# Altium project BLDC_DRIVER_DOOR.PrjPcb
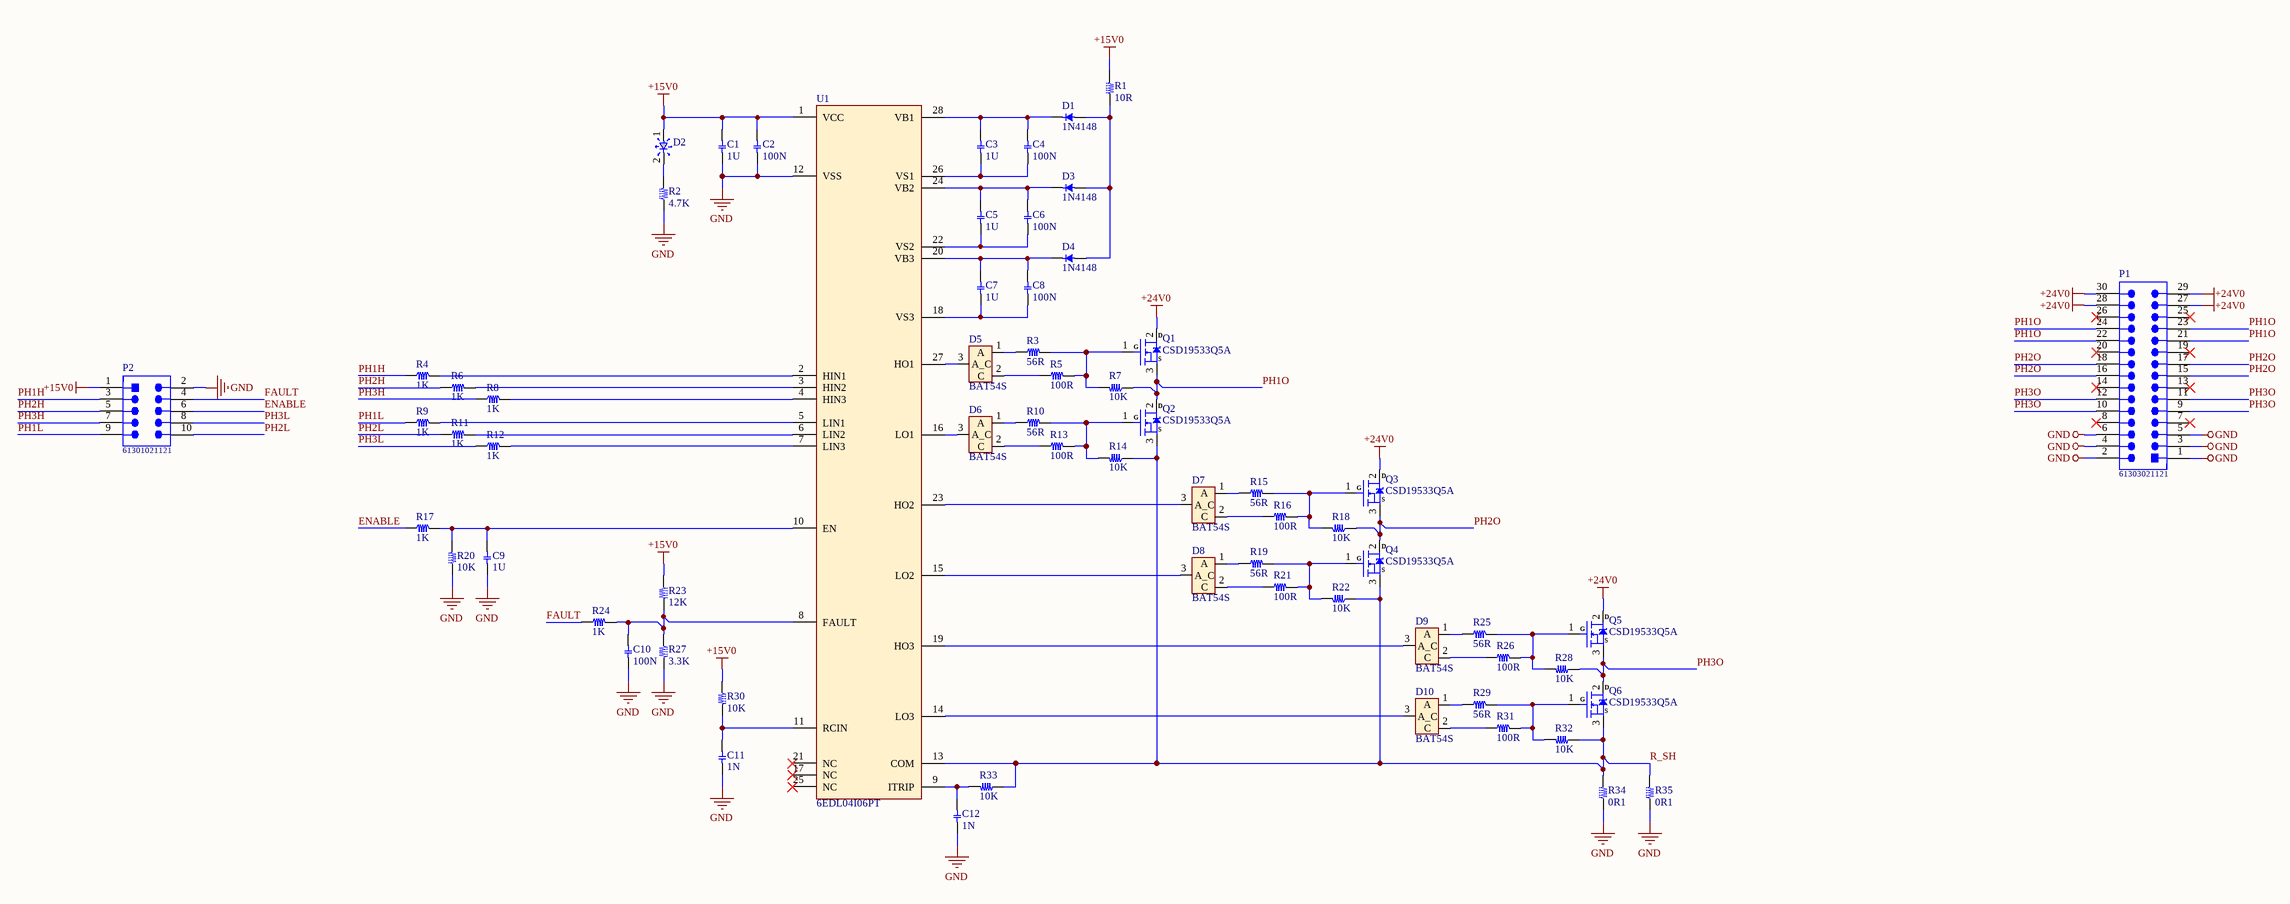
[diagram p0: BLDC_DRIVER_DOOR.SchDoc]
1 sheet, 66 parts. Net scope: global (net labels, ports and power ports of the same name join across sheets).
Board file: BLDC_DRIVER_DOOR.PcbDoc

## Sheet BLDC_DRIVER_DOOR.SchDoc
size A0; SheetNumber: 1; SheetTotal: 1

### Parts
C1  1U  [C 0603]
C2  100N  [C 0603]
C3  1U  [C 0805]
C4  100N  [C 0805]
C5  1U  [C 0805]
C6  100N  [C 0805]
C7  1U  [C 0805]
C8  100N  [C 0805]
C9  1U  [C 0603]
C10  100N  [C 0603]
C11  1N  [C 0603]
C12  1N  [C 0805]
D1  1N4148  [D SOD-123]
D2  LED_SMD  [D 0603]  (value not drawn)
D3  1N4148  [D SOD-123]
D4  1N4148  [D SOD-123]
D5  BAT54S  [SOT-23_3_D]
D6  BAT54S  [SOT-23_3_D]
D7  BAT54S  [SOT-23_3_D]
D8  BAT54S  [SOT-23_3_D]
D9  BAT54S  [SOT-23_3_D]
D10  BAT54S  [SOT-23_3_D]
P1  61303021121  [61303021121]
P2  61301021121  [61301021121]
Q1  CSD19533Q5A  [Q5A]
Q2  CSD19533Q5A  [Q5A]
Q3  CSD19533Q5A  [Q5A]
Q4  CSD19533Q5A  [Q5A]
Q5  CSD19533Q5A  [Q5A]
Q6  CSD19533Q5A  [Q5A]
R1  10R  [R 1206]
R2  4.7K  [R 0603]
R3  56R  [R 0805]
R4  1K  [R 0603]
R5  100R  [R 0805]
R6  1K  [R 0603]
R7  10K  [R 0603]
R8  1K  [R 0603]
R9  1K  [R 0603]
R10  56R  [R 0805]
R11  1K  [R 0603]
R12  1K  [R 0603]
R13  100R  [R 0805]
R14  10K  [R 0603]
R15  56R  [R 0805]
R16  100R  [R 0805]
R17  1K  [R 0603]
R18  10K  [R 0603]
R19  56R  [R 0805]
R20  10K  [R 0603]
R21  100R  [R 0805]
R22  10K  [R 0603]
R23  12K  [R 0603]
R24  1K  [R 0603]
R25  56R  [R 0805]
R26  100R  [R 0805]
R27  3.3K  [R 0603]
R28  10K  [R 0603]
R29  56R  [R 0805]
R30  10K  [R 0603]
R31  100R  [R 0805]
R32  10K  [R 0603]
R33  10K  [R 0805]
R34  0R1  [R 2512]
R35  0R1  [R 2512]
U1  6EDL04I06PT  [SOIC-28]

### Nets
+15V0: C1.2 C2.2 D2.1 P2.1 R1.2 R23.1 R30.1 U1.1(VCC)
+24V0: P1.27 P1.28 P1.29 P1.30 Q1.2(D) Q3.2(D) Q5.2(D)
GND: C1.1 C2.1 C9.1 C10.1 C11.1 C12.1 P1.1 P1.2 P1.3 P1.4 P1.5 P1.6 P2.2 R2.1 R20.1 R27.2 R34.1 R35.1 U1.12(VSS)
ENABLE: P2.6 R17.1
FAULT: P2.4 R24.1
PH1H: P2.3 R4.1
PH1L: P2.9 R9.1
PH1O: P1.21 P1.22 P1.23 P1.24 Q1.3(S) Q2.2(D) R7.1
PH2H: P2.5 R6.1
PH2L: P2.10 R11.1
PH2O: P1.15 P1.16 P1.17 P1.18 Q3.3(S) Q4.2(D) R18.1
PH3H: P2.7 R8.1
PH3L: P2.8 R12.1
PH3O: P1.9 P1.10 P1.11 P1.12 Q5.3(S) Q6.2(D) R28.1
R_SH: Q2.3(S) Q4.3(S) Q6.3(S) R14.1 R22.1 R32.1 R33.1 R34.2 R35.2 U1.13(COM)
NetC3_1: C3.1 C4.1 U1.26(VS1)
NetC3_2: C3.2 C4.2 D1.2 U1.28(VB1)
NetC5_1: C5.1 C6.1 U1.22(VS2)
NetC5_2: C5.2 C6.2 D3.2 U1.24(VB2)
NetC7_1: C7.1 C8.1 U1.18(VS3)
NetC7_2: C7.2 C8.2 D4.2 U1.20(VB3)
NetC9_2: C9.2 R17.2 R20.2 U1.10(EN)
NetC10_2: C10.2 R23.2 R24.2 R27.1 U1.8(FAULT)
NetC11_2: C11.2 R30.2 U1.11(RCIN)
NetC12_2: C12.2 R33.2 U1.9(ITRIP)
NetD1_1: D1.1 D3.1 D4.1 R1.1
NetD2_2: D2.2 R2.2
NetD5_1: D5.1(A) R3.1
NetD5_2: D5.2(C) R5.1
NetD5_3: D5.3(A_C) U1.27(HO1)
NetD6_1: D6.1(A) R10.1
NetD6_2: D6.2(C) R13.1
NetD6_3: D6.3(A_C) U1.16(LO1)
NetD7_1: D7.1(A) R15.1
NetD7_2: D7.2(C) R16.1
NetD7_3: D7.3(A_C) U1.23(HO2)
NetD8_1: D8.1(A) R19.1
NetD8_2: D8.2(C) R21.1
NetD8_3: D8.3(A_C) U1.15(LO2)
NetD9_1: D9.1(A) R25.1
NetD9_2: D9.2(C) R26.1
NetD9_3: D9.3(A_C) U1.19(HO3)
NetD10_1: D10.1(A) R29.1
NetD10_2: D10.2(C) R31.1
NetD10_3: D10.3(A_C) U1.14(LO3)
NetQ1_1: Q1.1(G) R3.2 R5.2 R7.2
NetQ2_1: Q2.1(G) R10.2 R13.2 R14.2
NetQ3_1: Q3.1(G) R15.2 R16.2 R18.2
NetQ4_1: Q4.1(G) R19.2 R21.2 R22.2
NetQ5_1: Q5.1(G) R25.2 R26.2 R28.2
NetQ6_1: Q6.1(G) R29.2 R31.2 R32.2
NetR4_2: R4.2 U1.2(HIN1)
NetR6_2: R6.2 U1.3(HIN2)
NetR8_2: R8.2 U1.4(HIN3)
NetR9_2: R9.2 U1.5(LIN1)
NetR11_2: R11.2 U1.6(LIN2)
NetR12_2: R12.2 U1.7(LIN3)

Not connected (* = marked no-connect by the designer): P1 7* 8* 13* 14* 19* 20* 25* 26*; U1 17(NC)* 21(NC)* 25(NC)*

### Library data of the parts
C1-C12 = CAP_SMD
D1 D3 D4 = DIOD_SMD
P1 = 61303021121: WR-PHD Pin Header, THT, pitch 2.54mm, Dual Row, Vertical, 30p; Manufacturer: Wurth Elektronik; Pin Number: 30; Rated Current: 3A; Working Voltage: 250VAC; Withstanding Voltage: 500VAC; Contact Resistance: 20mOhm; ComponentLink1Description: Manufacturer; ComponentLink1URL: http://www.we-online.de; ComponentLink2Description: Datasheet; ComponentLink2URL: https://www.we-online.com/catalog/datasheet/61303021121.pdf; Manufacturer Part Number: 61303021121; Pitch: 2.54mm; Operating Temperature: -40 to +105degC; Mounting Technology: THT; Packaging: Bag; Gender: Pin Header; Row Number: Dual; Orientation: Vertical
P2 = 61301021121: WR-PHD Pin Header, THT, pitch 2.54mm, Dual Row, Vertical, 10p; Manufacturer: Wurth Elektronik; Pin Number: 10; Rated Current: 3A; Working Voltage: 250VAC; Withstanding Voltage: 500VAC; Contact Resistance: 20mOhm; ComponentLink1Description: Manufacturer; ComponentLink1URL: http://www.we-online.de; ComponentLink2Description: Datasheet; ComponentLink2URL: https://www.we-online.com/catalog/datasheet/61301021121.pdf; Manufacturer Part Number: 61301021121; Pitch: 2.54mm; Operating Temperature: -40 to +105degC; Mounting Technology: THT; Packaging: Bag; Gender: Pin Header; Row Number: Dual; Orientation: Vertical
R1-R35 = RES_SMD